# Altium schematic sheet Moteurs_schem.SchDoc
size A4
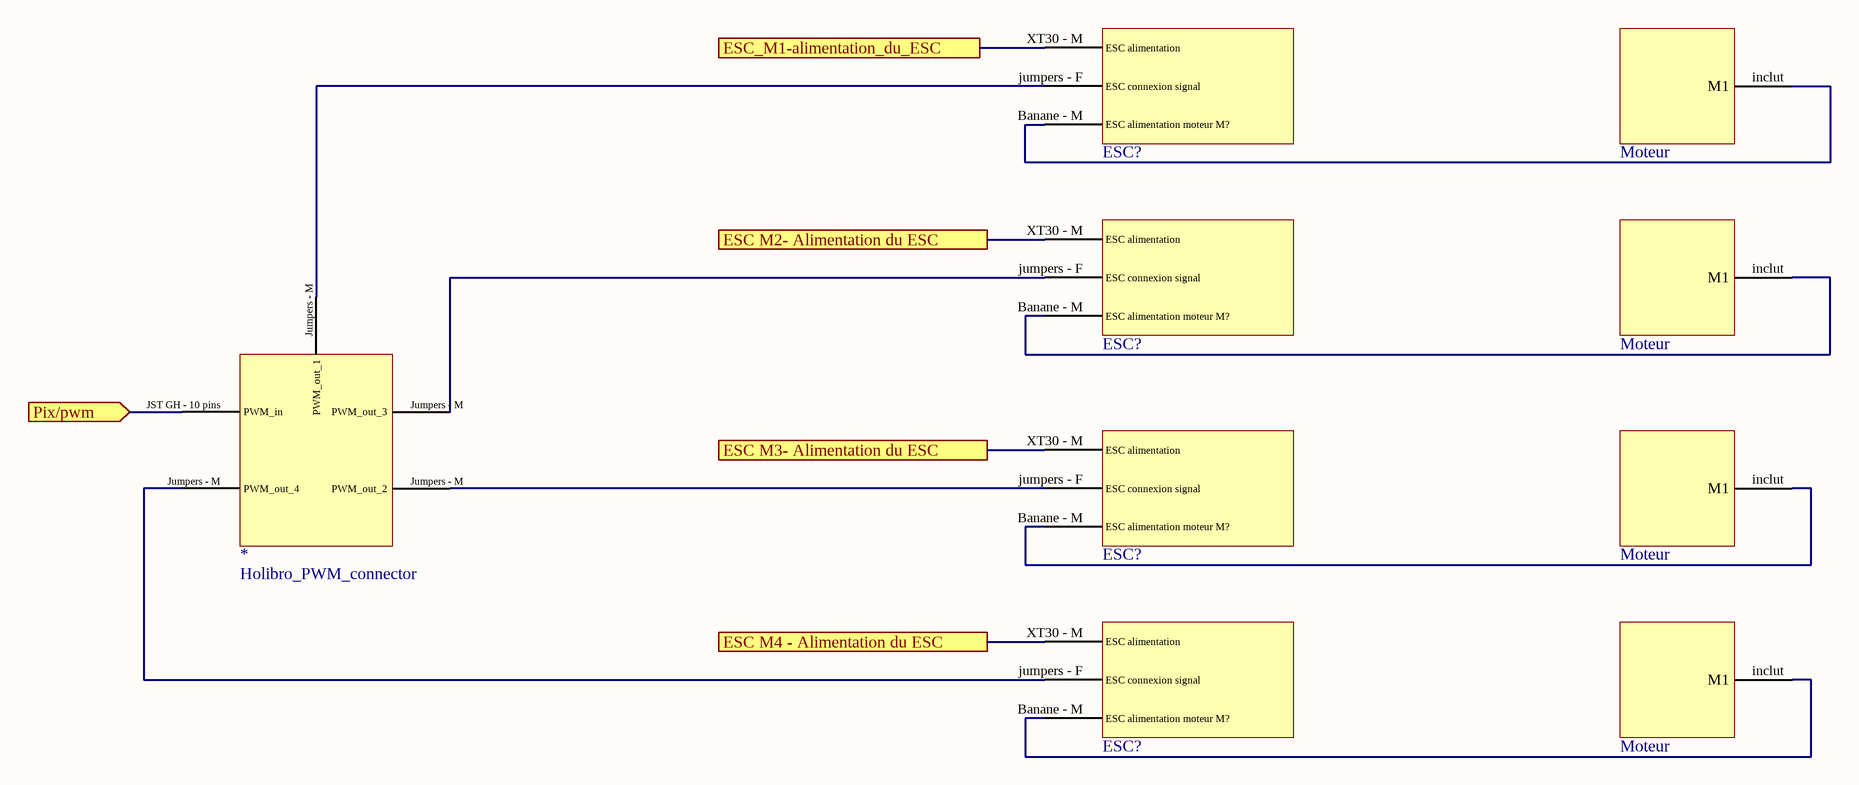
[diagram p0: Moteurs_schem.SchDoc]

## Parts
(Parts that share a designator on the sheet are numbered #1, #2 ... from top to bottom, then left to right.)
*  Holibro_PWM_connector
ESC?#1  ESC  (value not drawn)
ESC?#2  ESC  (value not drawn)
ESC?#3  ESC  (value not drawn)
ESC?#4  ESC  (value not drawn)
M?#1  Moteur
M?#2  Moteur
M?#3  Moteur
M?#4  Moteur

## Ports
ESC M2- Alimentation du ESC, ESC M3- Alimentation du ESC, ESC M4 - Alimentation du ESC, ESC_M1-alimentation_du_ESC, Pix/pwm (in)

## Nets
ESC M2- Alimentation du ESC: ESC?#2.XT30_-_M(ESC_alimentation) ; port ESC M2- Alimentation du ESC
ESC M3- Alimentation du ESC: ESC?#3.XT30_-_M(ESC_alimentation) ; port ESC M3- Alimentation du ESC
ESC M4 - Alimentation du ESC: ESC?#4.XT30_-_M(ESC_alimentation) ; port ESC M4 - Alimentation du ESC
ESC_M1-alimentation_du_ESC: ESC?#1.XT30_-_M(ESC_alimentation) ; port ESC_M1-alimentation_du_ESC
Pix/pwm: *.JST_GH_-_10_pins(PWM_in) ; port Pix/pwm
Net*_Jumpers - M: *.Jumpers_-_M(PWM_out_1) ESC?#1.jumpers_-_F(ESC_connexion_signal)
Net*_Jumpers - M: *.Jumpers_-_M(PWM_out_3) ESC?#2.jumpers_-_F(ESC_connexion_signal)  [a separate net that carries the same name]
Net*_Jumpers - M: *.Jumpers_-_M(PWM_out_2) ESC?#3.jumpers_-_F(ESC_connexion_signal)  [a separate net that carries the same name]
Net*_Jumpers - M: *.Jumpers_-_M(PWM_out_4) ESC?#4.jumpers_-_F(ESC_connexion_signal)  [a separate net that carries the same name]
NetESC?#1_Banane - M: ESC?#1.Banane_-_M(ESC_alimentation_moteur_M?) M?#1.inclut(M1)
NetESC?#2_Banane - M: ESC?#2.Banane_-_M(ESC_alimentation_moteur_M?) M?#2.inclut(M1)
NetESC?#3_Banane - M: ESC?#3.Banane_-_M(ESC_alimentation_moteur_M?) M?#3.inclut(M1)
NetESC?#4_Banane - M: ESC?#4.Banane_-_M(ESC_alimentation_moteur_M?) M?#4.inclut(M1)